# EAGLE schematic 68000 (EAGLE 7.6.0)
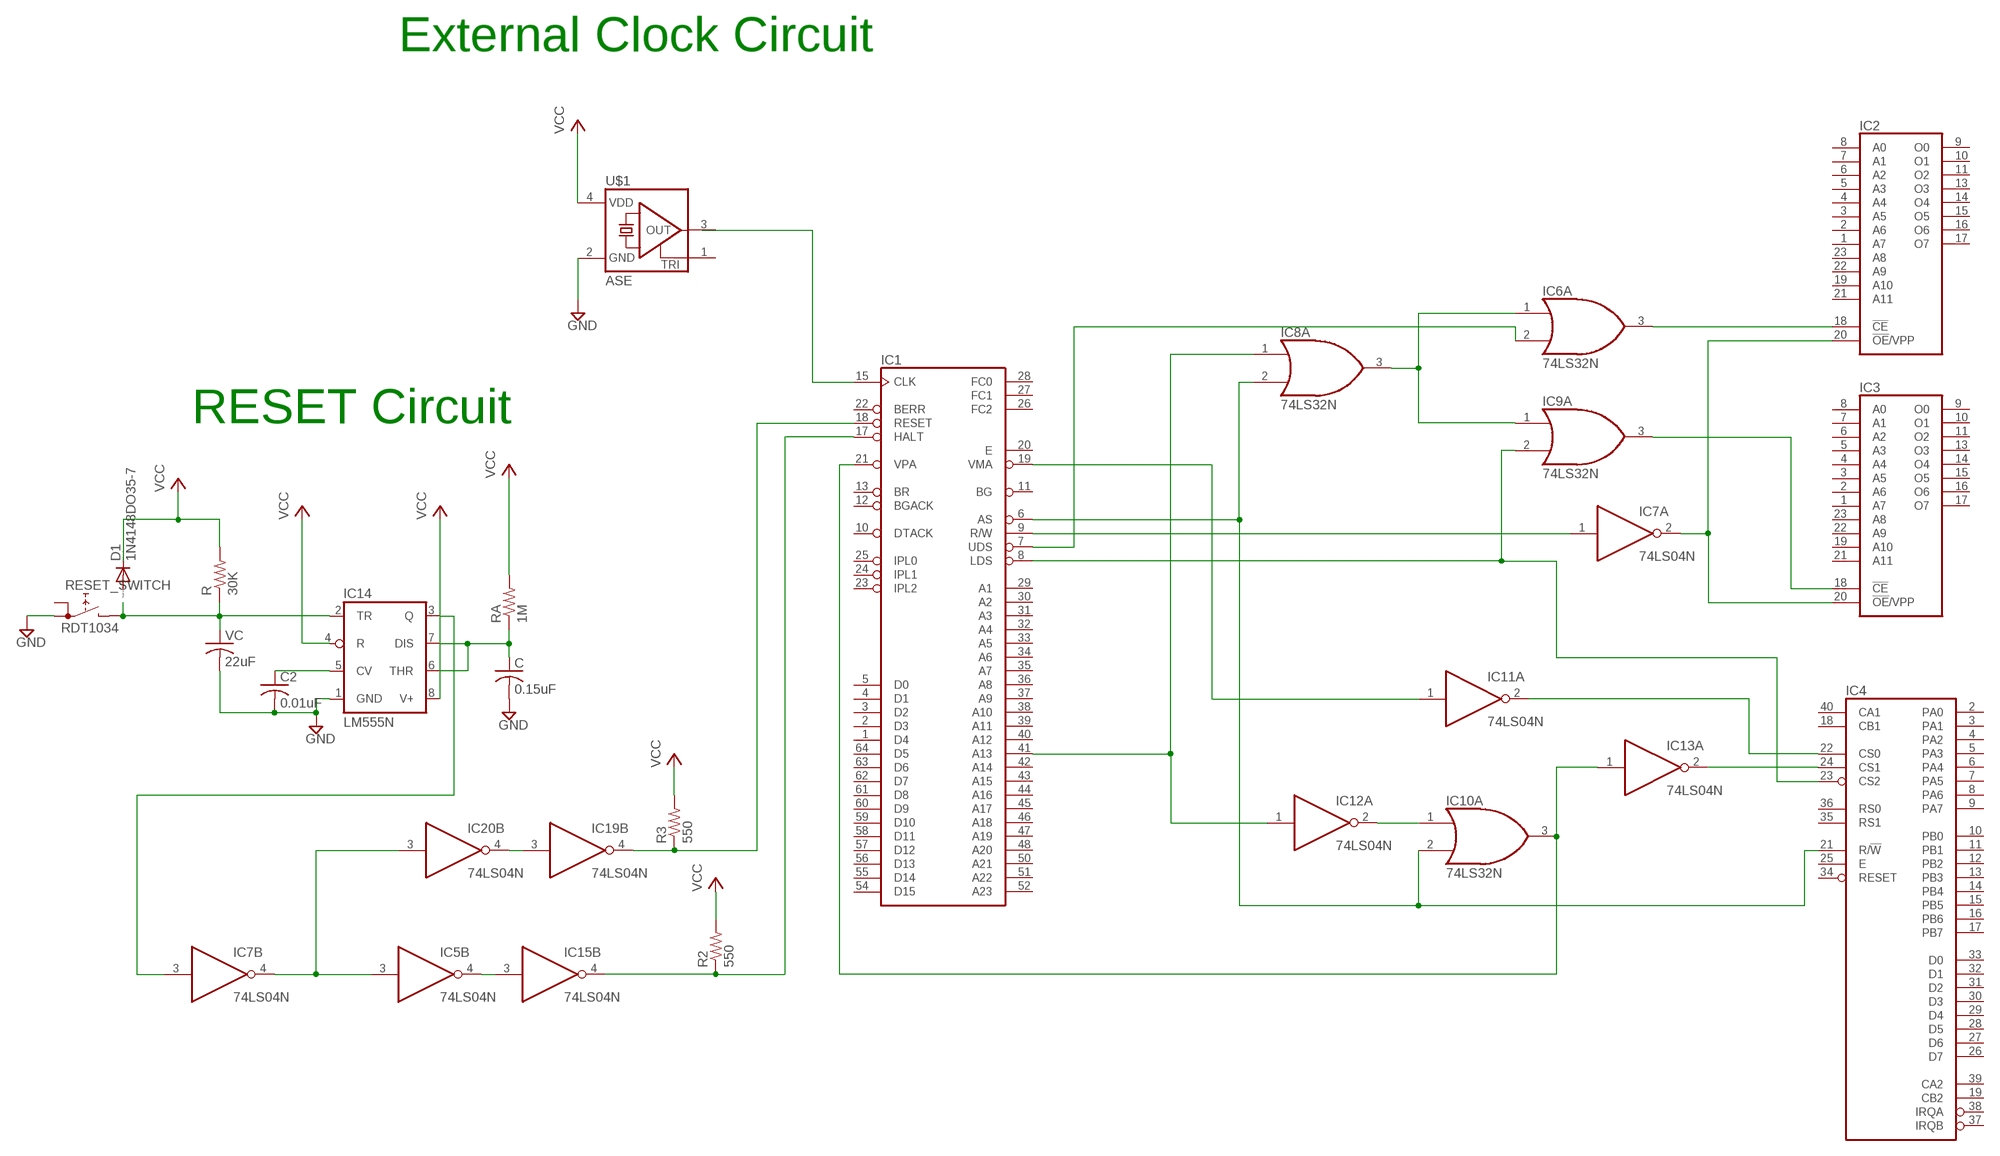
[diagram p0: schematic, sheet 1]

## Parts
C  0.15uF  C-US025-024X044  [C025-024X044]
C2  0.01uF  C-US025-024X044  [C025-024X044]
D1  1N4148DO35-7  [DO35-7]
IC1  MC68000P  [DIL64]
IC2  2732  [DIL24]
IC3  2732  [DIL24]
IC4  6821  [DIL40]
IC5  74LS04N  [DIL14]
IC6  74LS32N  [DIL14]
IC7  74LS04N  [DIL14]
IC8  74LS32N  [DIL14]
IC9  74LS32N  [DIL14]
IC10  74LS32N  [DIL14]
IC11  74LS04N  [DIL14]
IC12  74LS04N  [DIL14]
IC13  74LS04N  [DIL14]
IC14  LM555N  [DIL08]
IC15  74LS04N  [DIL14]
IC19  74LS04N  [DIL14]
IC20  74LS04N  [DIL14]
R  30K  R-US_0204/2V  [0204V]
R2  550  R-US_0204/2V  [0204V]
R3  550  R-US_0204/2V  [0204V]
RA  1M  R-US_0204/2V  [0204V]
RESET_SWITCH  RDT1034  [RDT1034]
U$1  ASE  [ASE]
VC  22uF  C-US025-024X044  [C025-024X044]

## Nets
GND: C2.2 C.2 IC14.1(GND) RESET_SWITCH.A1 U$1.2(GND) VC.2
N$1: IC1.9(R/W) IC7.1(A:I)
N$2: IC4.24(CS1) IC13.2(A:O)
N$3: IC1.41(A13) IC8.1(A:I0) IC12.1(A:I)
N$4: IC6.1(A:I0) IC8.3(A:O) IC9.1(A:I0)
N$5: IC2.20(!OE!/VPP) IC3.20(!OE!/VPP) IC7.2(A:O)
N$8: IC1.7(UDS) IC6.2(A:I1)
N$9: IC1.8(LDS) IC4.23(CS2) IC9.2(A:I1)
N$10: IC1.6(AS) IC4.21(R/!W) IC8.2(A:I1) IC10.2(A:I1)
N$11: IC4.22(CS0) IC11.2(A:O)
N$12: IC1.19(VMA) IC11.1(A:I)
N$13: IC10.1(A:I0) IC12.2(A:O)
N$14: IC1.21(VPA) IC10.3(A:O) IC13.1(A:I)
N$15: C2.1 IC14.5(CV)
N$16: IC14.2(TR) R.1 RESET_SWITCH.B VC.1
N$17: IC2.18(!CE) IC6.3(A:O)
N$18: C.1 IC14.6(THR) IC14.7(DIS) RA.1
N$19: IC7.3(B:I) IC14.3(Q)
N$20: IC5.4(B:O) IC15.3(B:I)
N$21: IC1.17(HALT) IC15.4(B:O) R2.1
N$22: IC1.18(RESET) IC19.4(B:O) R3.1
N$23: IC3.18(!CE) IC9.3(A:O)
N$26: IC1.15(CLK)
N$27: IC5.3(B:I) IC7.4(B:O) IC20.3(B:I)
N$28: IC19.3(B:I) IC20.4(B:O)
VCC: D1.C IC14.4(R) IC14.8(V+) R2.2 R3.2 R.2 RA.2 U$1.4(VDD)
Unconnected: D1.A IC1.1(D4) IC1.2(D3) IC1.3(D2) IC1.4(D1) IC1.5(D0) IC1.10(DTACK) IC1.11(BG) IC1.12(BGACK) IC1.13(BR) IC1.20(E) IC1.22(BERR) IC1.23(IPL2) IC1.24(IPL1) IC1.25(IPL0) IC1.26(FC2) IC1.27(FC1) IC1.28(FC0) IC1.29(A1) IC1.30(A2) IC1.31(A3) IC1.32(A4) IC1.33(A5) IC1.34(A6) IC1.35(A7) IC1.36(A8) IC1.37(A9) IC1.38(A10) IC1.39(A11) IC1.40(A12) IC1.42(A14) IC1.43(A15) IC1.44(A16) IC1.45(A17) IC1.46(A18) IC1.47(A19) IC1.48(A20) IC1.50(A21) IC1.51(A22) IC1.52(A23) IC1.54(D15) IC1.55(D14) IC1.56(D13) IC1.57(D12) IC1.58(D11) IC1.59(D10) IC1.60(D9) IC1.61(D8) IC1.62(D7) IC1.63(D6) IC1.64(D5) IC2.1(A7) IC2.2(A6) IC2.3(A5) IC2.4(A4) IC2.5(A3) IC2.6(A2) IC2.7(A1) IC2.8(A0) IC2.9(O0) IC2.10(O1) IC2.11(O2) IC2.13(O3) IC2.14(O4) IC2.15(O5) IC2.16(O6) IC2.17(O7) IC2.19(A10) IC2.21(A11) IC2.22(A9) IC2.23(A8) IC3.1(A7) IC3.2(A6) IC3.3(A5) IC3.4(A4) IC3.5(A3) IC3.6(A2) IC3.7(A1) IC3.8(A0) IC3.9(O0) IC3.10(O1) IC3.11(O2) IC3.13(O3) IC3.14(O4) IC3.15(O5) IC3.16(O6) IC3.17(O7) IC3.19(A10) IC3.21(A11) IC3.22(A9) IC3.23(A8) IC4.2(PA0) IC4.3(PA1) IC4.4(PA2) IC4.5(PA3) IC4.6(PA4) IC4.7(PA5) IC4.8(PA6) IC4.9(PA7) IC4.10(PB0) IC4.11(PB1) IC4.12(PB2) IC4.13(PB3) IC4.14(PB4) IC4.15(PB5) IC4.16(PB6) IC4.17(PB7) IC4.18(CB1) IC4.19(CB2) IC4.25(E) IC4.26(D7) IC4.27(D6) IC4.28(D5) IC4.29(D4) IC4.30(D3) IC4.31(D2) IC4.32(D1) IC4.33(D0) IC4.34(RESET) IC4.35(RS1) IC4.36(RS0) IC4.37(IRQB) IC4.38(IRQA) IC4.39(CA2) IC4.40(CA1) IC5.1(A:I) IC5.2(A:O) IC5.5(C:I) IC5.6(C:O) IC5.8(D:O) IC5.9(D:I) IC5.10(E:O) IC5.11(E:I) IC5.12(F:O) IC5.13(F:I) IC6.4(B:I0) IC6.5(B:I1) IC6.6(B:O) IC6.8(C:O) IC6.9(C:I0) IC6.10(C:I1) IC6.11(D:O) IC6.12(D:I0) IC6.13(D:I1) IC7.5(C:I) IC7.6(C:O) IC7.8(D:O) IC7.9(D:I) IC7.10(E:O) IC7.11(E:I) IC7.12(F:O) IC7.13(F:I) IC8.4(B:I0) IC8.5(B:I1) IC8.6(B:O) IC8.8(C:O) IC8.9(C:I0) IC8.10(C:I1) IC8.11(D:O) IC8.12(D:I0) IC8.13(D:I1) IC9.4(B:I0) IC9.5(B:I1) IC9.6(B:O) IC9.8(C:O) IC9.9(C:I0) IC9.10(C:I1) IC9.11(D:O) IC9.12(D:I0) IC9.13(D:I1) IC10.4(B:I0) IC10.5(B:I1) IC10.6(B:O) IC10.8(C:O) IC10.9(C:I0) IC10.10(C:I1) IC10.11(D:O) IC10.12(D:I0) IC10.13(D:I1) IC11.3(B:I) IC11.4(B:O) IC11.5(C:I) IC11.6(C:O) IC11.8(D:O) IC11.9(D:I) IC11.10(E:O) IC11.11(E:I) IC11.12(F:O) IC11.13(F:I) IC12.3(B:I) IC12.4(B:O) IC12.5(C:I) IC12.6(C:O) IC12.8(D:O) IC12.9(D:I) IC12.10(E:O) IC12.11(E:I) IC12.12(F:O) IC12.13(F:I) IC13.3(B:I) IC13.4(B:O) IC13.5(C:I) IC13.6(C:O) IC13.8(D:O) IC13.9(D:I) IC13.10(E:O) IC13.11(E:I) IC13.12(F:O) IC13.13(F:I) IC15.1(A:I) IC15.2(A:O) IC15.5(C:I) IC15.6(C:O) IC15.8(D:O) IC15.9(D:I) IC15.10(E:O) IC15.11(E:I) IC15.12(F:O) IC15.13(F:I) IC19.1(A:I) IC19.2(A:O) IC19.5(C:I) IC19.6(C:O) IC19.8(D:O) IC19.9(D:I) IC19.10(E:O) IC19.11(E:I) IC19.12(F:O) IC19.13(F:I) IC20.1(A:I) IC20.2(A:O) IC20.5(C:I) IC20.6(C:O) IC20.8(D:O) IC20.9(D:I) IC20.10(E:O) IC20.11(E:I) IC20.12(F:O) IC20.13(F:I) RESET_SWITCH.A U$1.1(TRI) U$1.3(OUT)

## Notes on the sheet
- External Clock Circuit
- RESET Circuit

## Power pins joined to a net without a drawn wire
GND: IC1.16(GND) IC1.53(GND) IC2.12(GND) IC3.12(GND) IC5.7(P:GND) IC6.7(P:GND) IC7.7(P:GND) IC8.7(P:GND) IC9.7(P:GND) IC10.7(P:GND) IC11.7(P:GND) IC12.7(P:GND) IC13.7(P:GND) IC15.7(P:GND) IC19.7(P:GND) IC20.7(P:GND)
VCC: IC1.14(VCC) IC1.49(VCC) IC2.24(VCC) IC3.24(VCC) IC4.20(VCC) IC5.14(P:VCC) IC6.14(P:VCC) IC7.14(P:VCC) IC8.14(P:VCC) IC9.14(P:VCC) IC10.14(P:VCC) IC11.14(P:VCC) IC12.14(P:VCC) IC13.14(P:VCC) IC15.14(P:VCC) IC19.14(P:VCC) IC20.14(P:VCC)
VSS: IC4.1(VSS)

## Library data of the parts
C C2 VC = rcl:C-US: CAPACITOR, American symbol
D1 = diode:1N4148: DIODE high speed (Philips)
IC1 = micro-mc68000:MC68000P: 68xxx PROCESSOR; OC_FARNELL: unknown; OC_NEWARK: unknown
IC2 IC3 = memory:2732: MEMORY
IC4 = micro-motorola:6821: MICROCONTROLLER/MEMORY DEVICE; MF: NTE ELECTRONICS; MPN: NTE6821; OC_FARNELL: 1652403; OC_NEWARK: 29C4772
IC5 IC7 IC11-IC13 IC15 IC19 IC20 = 74xx-us:74*04: Hex INVERTER
IC6 IC8-IC10 = 74xx-us:74*32: Quad 2-input OR gate
IC14 = linear:*555: TIMER
R R2 R3 RA = resistor:R-US_: RESISTOR, American symbol
RESET_SWITCH = switch:RDT1034: PUSH SWITCH www.radiohm.com
U$1 = crystal:ASE: 3.3Vdc CMOS SMD CRYSTAL CLOCK OSCILLATOR SOurce: www.abracon.com; OC_FARNELL: unknown; OC_NEWARK: unknown